# EAGLE design mainboard (EAGLE 9.6.1)
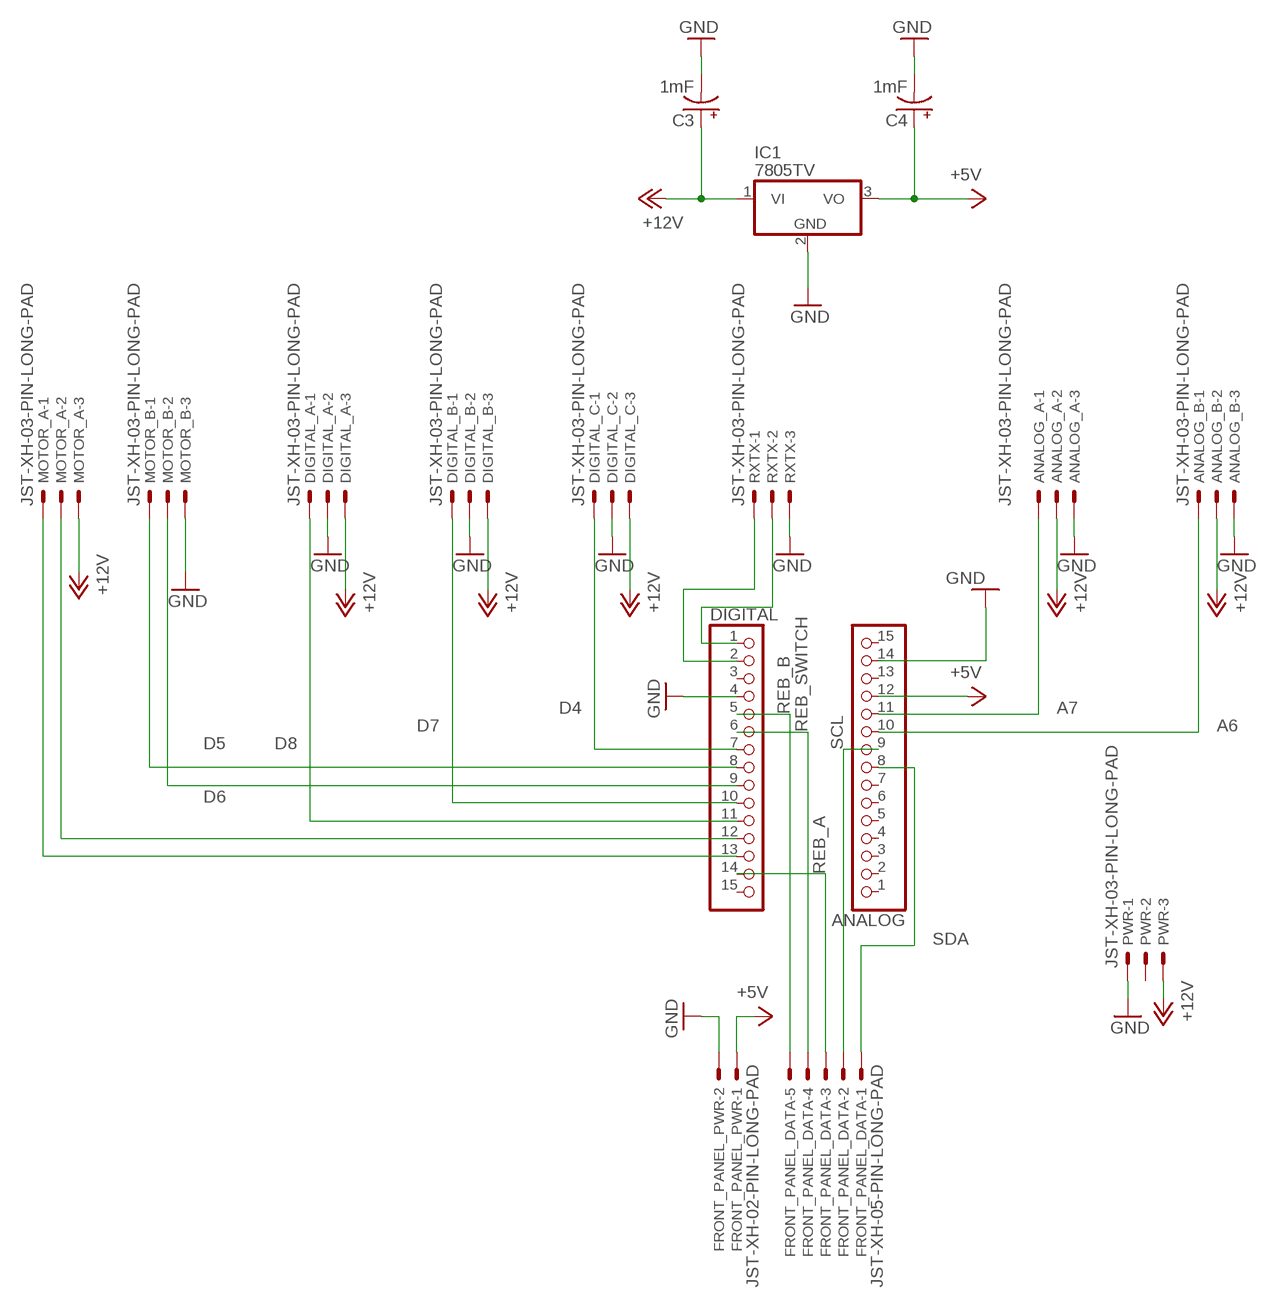
[diagram p0: schematic, sheet 1]

## Parts
ANALOG  PINHD-1X15  [1X15]
ANALOG_A  JST-XH-03-PIN-LONG-PAD  [JST-XH-03-PACKAGE-LONG-PAD]
ANALOG_B  JST-XH-03-PIN-LONG-PAD  [JST-XH-03-PACKAGE-LONG-PAD]
C3  1mF  1000UF-RADIAL-5MM-25V-20%  [CPOL-RADIAL-5MM-10MM]
C4  1mF  1000UF-RADIAL-5MM-25V-20%  [CPOL-RADIAL-5MM-10MM]
DIGITAL  PINHD-1X15  [1X15]
DIGITAL_A  JST-XH-03-PIN-LONG-PAD  [JST-XH-03-PACKAGE-LONG-PAD]
DIGITAL_B  JST-XH-03-PIN-LONG-PAD  [JST-XH-03-PACKAGE-LONG-PAD]
DIGITAL_C  JST-XH-03-PIN-LONG-PAD  [JST-XH-03-PACKAGE-LONG-PAD]
FRONT_PANEL_DATA  JST-XH-05-PIN-LONG-PAD  [JST-XH-05-PACKAGE-LONG-PAD]
FRONT_PANEL_PWR  JST-XH-02-PIN-LONG-PAD  [JST-XH-02-PACKAGE-LONG-PAD]
IC1  7805TV  [TO220V]
MOTOR_A  JST-XH-03-PIN-LONG-PAD  [JST-XH-03-PACKAGE-LONG-PAD]
MOTOR_B  JST-XH-03-PIN-LONG-PAD  [JST-XH-03-PACKAGE-LONG-PAD]
PWR  JST-XH-03-PIN-LONG-PAD  [JST-XH-03-PACKAGE-LONG-PAD]
RXTX  JST-XH-03-PIN-LONG-PAD  [JST-XH-03-PACKAGE-LONG-PAD]

## Nets
+5V: ANALOG.12 C4.+ FRONT_PANEL_PWR.1 IC1.3(VO)
+12V: ANALOG_A.2 ANALOG_B.2 C3.+ DIGITAL_A.3 DIGITAL_B.3 DIGITAL_C.3 IC1.1(VI) MOTOR_A.3 PWR.3
A6: ANALOG.10 ANALOG_B.1
A7: ANALOG.11 ANALOG_A.1
D4: DIGITAL.7 DIGITAL_C.1
D5: DIGITAL.8 MOTOR_B.1
D6: DIGITAL.9 MOTOR_B.2
D7: DIGITAL.10 DIGITAL_B.1
D8: DIGITAL.11 DIGITAL_A.1
D9: DIGITAL.12 MOTOR_A.2
D10: DIGITAL.13 MOTOR_A.1
GND: ANALOG.14 ANALOG_A.3 ANALOG_B.3 C3.- C4.- DIGITAL.4 DIGITAL_A.2 DIGITAL_B.2 DIGITAL_C.2 FRONT_PANEL_PWR.2 IC1.2(GND) MOTOR_B.3 PWR.1 RXTX.3
REB_A: DIGITAL.14 FRONT_PANEL_DATA.3
REB_B: DIGITAL.5 FRONT_PANEL_DATA.5
REB_SWITCH: DIGITAL.6 FRONT_PANEL_DATA.4
RXD: DIGITAL.2 RXTX.1
SCL: ANALOG.9 FRONT_PANEL_DATA.2
SDA: ANALOG.8 FRONT_PANEL_DATA.1
TXD: DIGITAL.1 RXTX.2
Unconnected: ANALOG.1 ANALOG.2 ANALOG.3 ANALOG.4 ANALOG.5 ANALOG.6 ANALOG.7 ANALOG.13 ANALOG.15 DIGITAL.3 DIGITAL.15 PWR.2

## Library data of the parts
ANALOG DIGITAL = pinhead:PINHD-1X15: PIN HEADER
ANALOG_A ANALOG_B DIGITAL_A DIGITAL_B DIGITAL_C MOTOR_A MOTOR_B PWR RXTX = Rembrandt Electronics - JST XH Connectors v1-0:JST-XH-03-PIN: JST XH Connector 2 Pin Wire to board connector. Pitch: 2,54 mm, (0.100") Number of pins: 3 Created by Rembrandt Electronics www.rembrandtelectronics.com
C3 C4 = SparkFun-Capacitors:1000UF: 1,000µF/1mF ceramic capacitors A capacitor is a passive two-terminal electrical component used to store electrical energy temporarily in an electric field. CAP-08070; PROD_ID: CAP-09538
FRONT_PANEL_DATA = Rembrandt Electronics - JST XH Connectors v1-0:JST-XH-05-PIN: JST XH Connector 2 Pin Wire to board connector. Pitch: 2,54 mm, (0.100") Number of pins: 5 Created by Rembrandt Electronics www.rembrandtelectronics.com
FRONT_PANEL_PWR = Rembrandt Electronics - JST XH Connectors v1-0:JST-XH-02-PIN: JST XH Connector 2 Pin Wire to board connector. Pitch: 2,54 mm, (0.100") Number of pins: 2 Created by Rembrandt Electronics www.rembrandtelectronics.com
IC1 = linear:78*: Positive VOLTAGE REGULATOR Source: http://cache.national.com/ds/LM/LM78L05.pdf http://www.fairchildsemi.com/ds/LM/LM7805.pdf

## Board
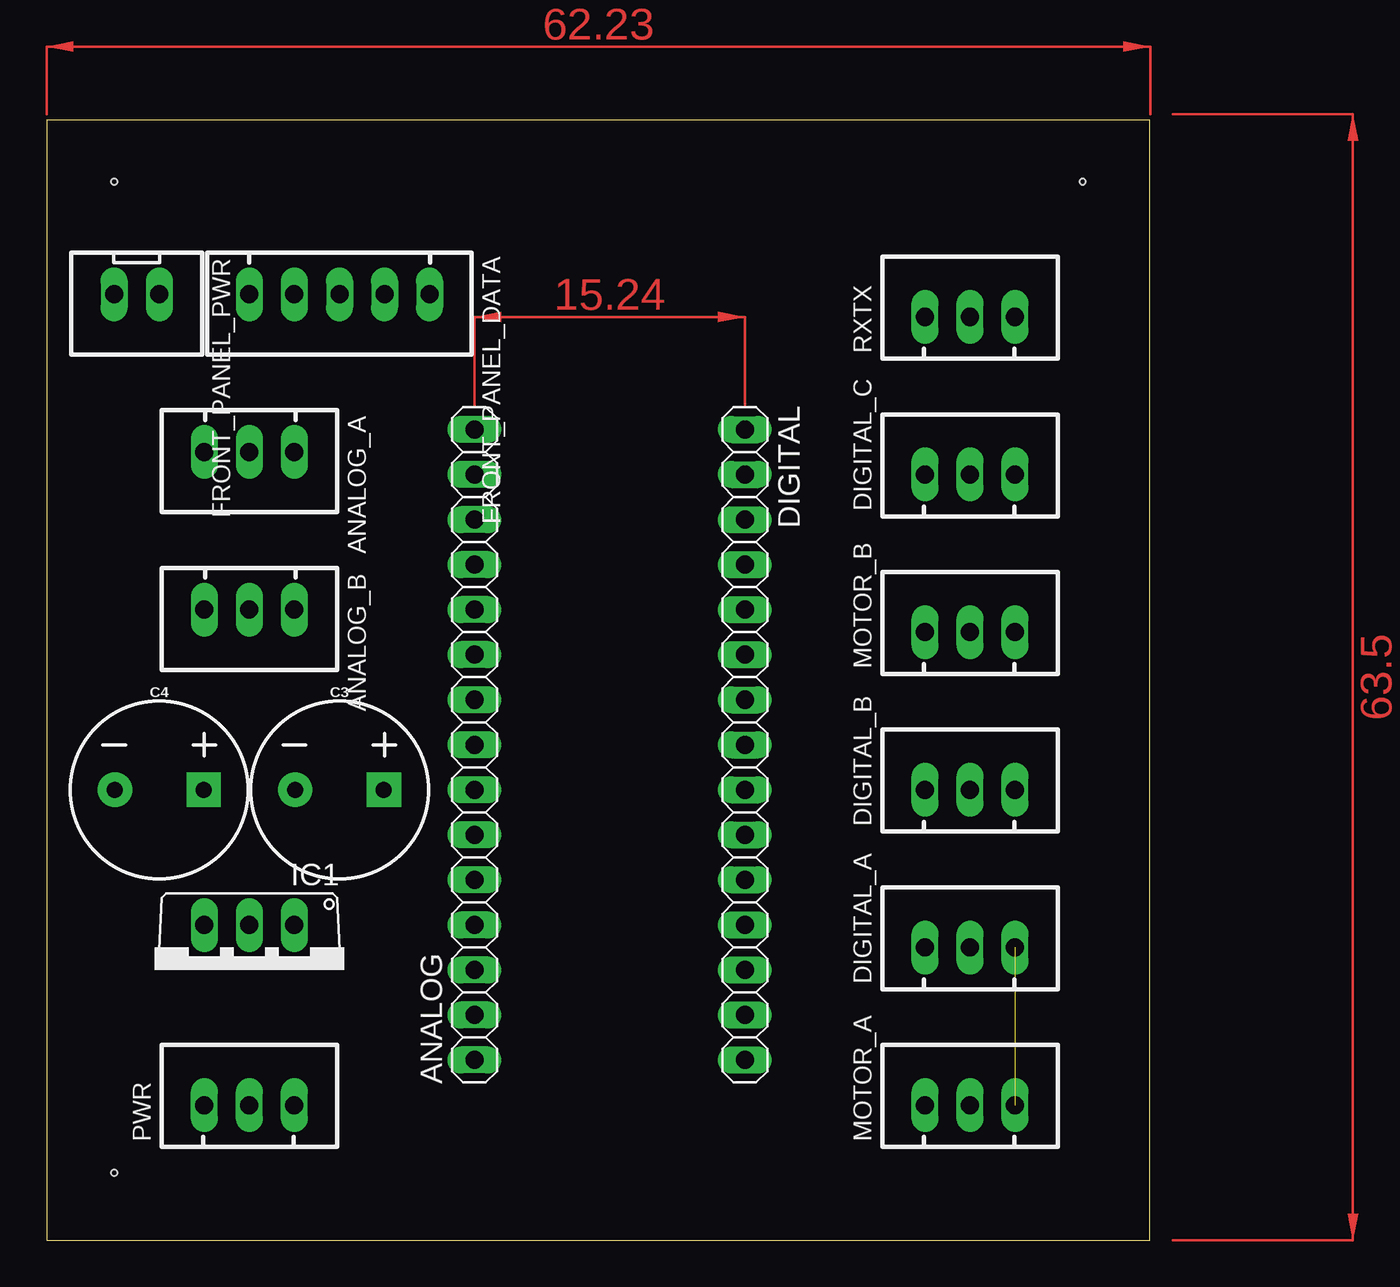
[diagram p1: board, top side]
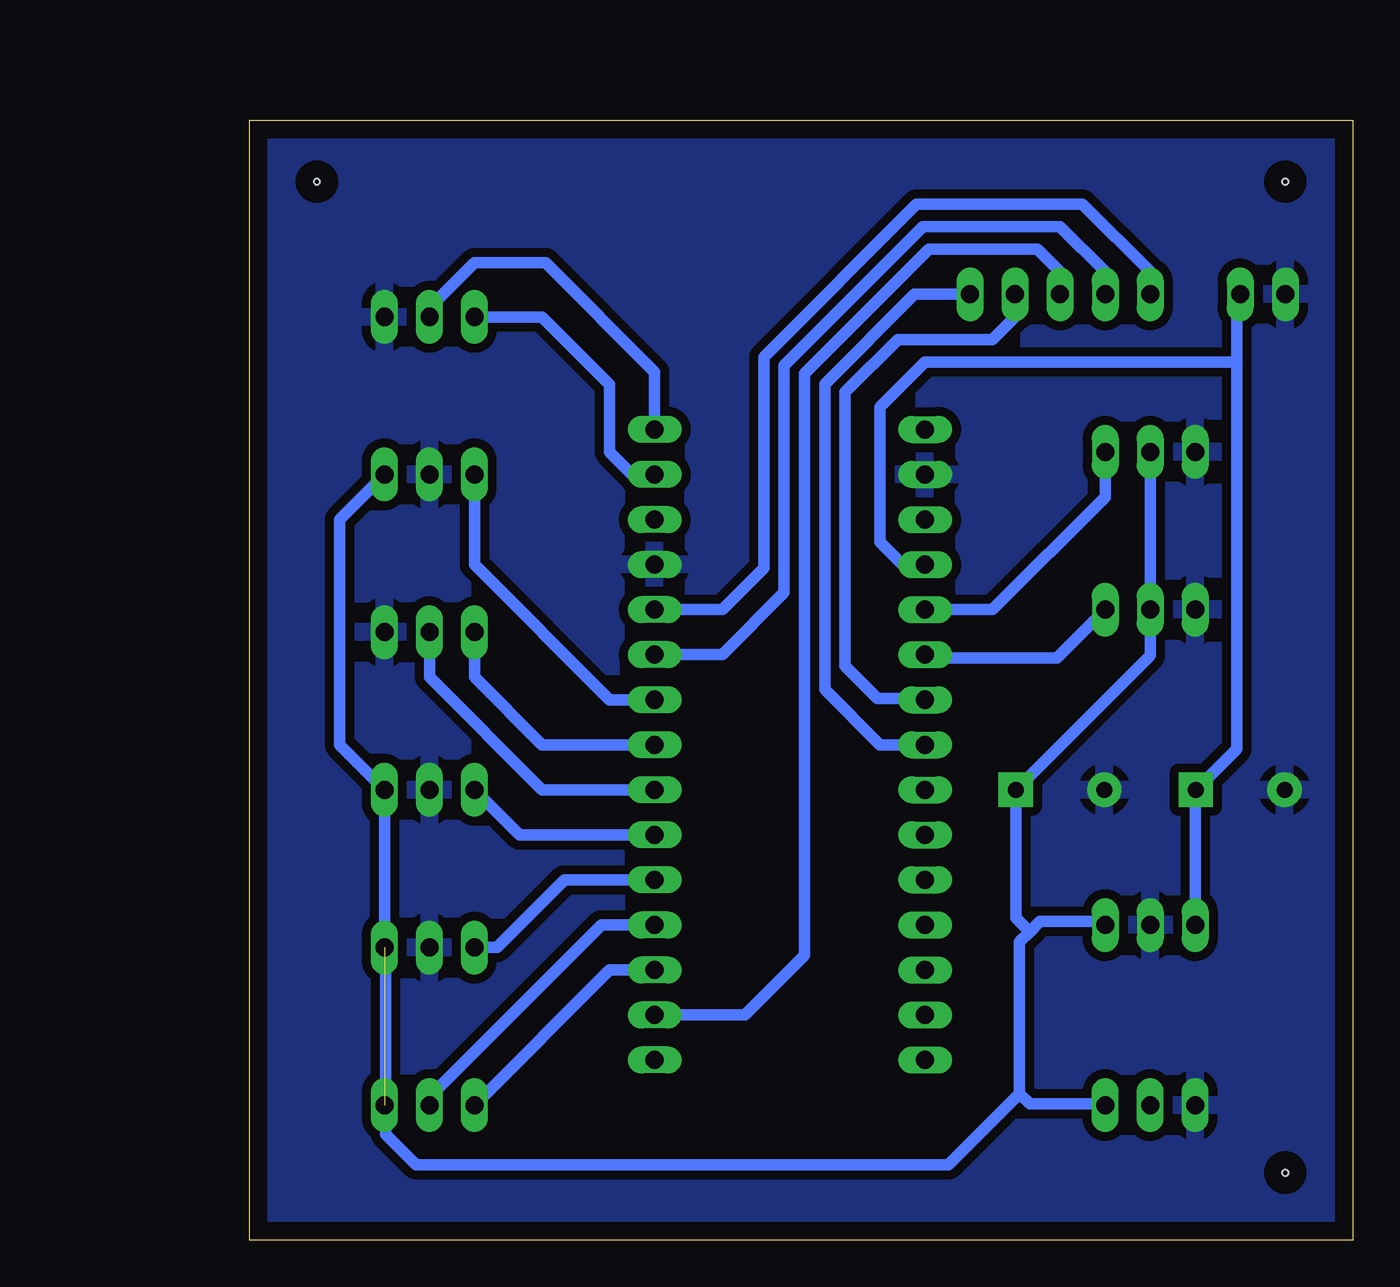
[diagram p2: board, bottom side, seen from below]

Size 62.21 x 63.17 mm. Coordinates in mm from the lower left corner, seen from the top.
Outline: 0,0 62.21,0 62.21,63.17 0,63.17 0,0
Copper layers (1*16): Top 0.035mm / dielectric 1.5mm / Bottom 0.035mm
Design rules "default2 *": minimum track width 25mil, minimum drill 0.35mm, track to track 20mil, track to pad 20mil, pad to pad 20mil, via to via 20mil, smd to smd 20mil, copper to edge 40mil, drill to drill 6mil, minimum pad ring 10mil, minimum via ring 8mil, stop-mask expansion 4mil, vias tented up to drill 0mil, thermal gap 20mil
Holes 0.35 mm at 3.81,3.81 58.42,59.69 3.81,59.69

### Footprints (pad centres in the part's own frame; a part is rotated, then mirrored left to right if it is on the bottom)
1X15 = drill 1.016 long: 1 -17.78,0; 2 -15.24,0; 3 -12.7,0; 4 -10.16,0; 5 -7.62,0; 6 -5.08,0; 7 -2.54,0; 8 0,0; 9 2.54,0; 10 5.08,0; 11 7.62,0; 12 10.16,0; 13 12.7,0; 14 15.24,0; 15 17.78,0
JST-XH-03-PACKAGE-LONG-PAD = drill 1.016 long: 1 -2.54,0; 2 0,0; 3 2.54,0
CPOL-RADIAL-5MM-10MM = drill 0.9 pad 1.93 square: + 2.5,0 | drill 0.9 pad 1.93: - -2.5,0
JST-XH-05-PACKAGE-LONG-PAD = drill 1.016 long: 1 -5.08,0; 2 -2.54,0; 3 0,0; 4 2.54,0; 5 5.08,0
JST-XH-02-PACKAGE-LONG-PAD = drill 1.016 long: 1 -1.27,0; 2 1.27,0
TO220V = drill 1.016 long: 1 -2.54,-2.54; 2 0,-2.54; 3 2.54,-2.54

### Placement (x,y rotation side)
ANALOG  24.13,27.94 90 top
ANALOG_A  11.43,44.45 180 top
ANALOG_B  11.43,35.56 180 top
C3  16.51,25.4 0 top
C4  6.35,25.4 0 top
DIGITAL  39.37,27.94 270 top
DIGITAL_A  52.07,16.51 0 top
DIGITAL_B  52.07,25.4 0 top
DIGITAL_C  52.07,43.18 0 top
FRONT_PANEL_DATA  16.51,53.34 180 top
FRONT_PANEL_PWR  5.08,53.34 180 top
IC1  11.43,15.24 180 top
MOTOR_A  52.07,7.62 0 top
MOTOR_B  52.07,34.29 0 top
PWR  11.43,7.62 0 top
RXTX  52.07,52.07 0 top

### Tracks (layer width: path | path; a pad name or v marks a point on that pad's centre or on a via)
+5V
  Bottom 0.635: 6.54,49.34 6.54,27.71 C4.+ | 6.54,49.34 6.6,49.34 6.79,49.53 24.13,49.53 26.67,46.99 26.67,39.37 25.4,38.1 ANALOG.12 | C4.+ 9.08,25.4 | 6.54,49.34 6.54,53.15 FRONT_PANEL_PWR.1 | C4.+ 8.89,25.36 IC1.3
+12V  (1 unrouted)
  Bottom 0.635: 18.8,8.26 18.22,7.68 13.97,7.68 PWR.3 | 18.8,8.26 18.8,16.83 18.22,17.4 | 18.22,17.4 17.65,17.97 13.97,17.97 IC1.1 | ANALOG_A.2 ANALOG_B.2 11.43,32.98 C3.+ 19.01,18.18 18.22,17.4 | 18.8,8.26 22.8,4.25 52.83,4.25 54.55,5.97 54.55,16.45 DIGITAL_A.3 DIGITAL_B.3 57.15,27.94 57.15,40.64 DIGITAL_C.3
A6
  Bottom 0.635: ANALOG_B.1 16.7,32.83 23.94,32.83 ANALOG.10
A7
  Bottom 0.635: ANALOG.11 20.32,35.56 13.97,41.91 ANALOG_A.1
D4
  Bottom 0.635: DIGITAL_C.1 49.53,38.1 41.91,30.48 DIGITAL.7
D5
  Bottom 0.635: MOTOR_B.1 49.53,31.75 45.72,27.94 DIGITAL.8
D6
  Bottom 0.635: MOTOR_B.2 52.07,31.75 45.72,25.4 DIGITAL.9
D7
  Bottom 0.635: DIGITAL_B.1 46.99,22.86 DIGITAL.10
D8
  Bottom 0.635: DIGITAL_A.1 48.26,16.51 44.45,20.32 DIGITAL.11
D9
  Bottom 0.635: MOTOR_A.2 52.07,8.09 42.38,17.78 DIGITAL.12
D10
  Bottom 0.635: DIGITAL.13 41.91,15.24 MOTOR_A.1
GND
  pour Bottom: 0,63.5 62.23,63.5 62.23,0 0,0
REB_A
  Bottom 0.635: DIGITAL.14 34.29,12.7 30.92,16.07 30.92,48.86 23.91,55.88 17.78,55.88 16.51,54.61 FRONT_PANEL_DATA.3
REB_B
  Bottom 0.635: DIGITAL.5 35.56,35.56 33.21,37.91 33.21,49.81 24.6,58.42 15.24,58.42 11.43,54.61 FRONT_PANEL_DATA.5
REB_SWITCH
  Bottom 0.635: DIGITAL.6 35.56,33.02 32.07,36.51 32.07,49.33 24.25,57.15 16.51,57.15 13.97,54.61 FRONT_PANEL_DATA.4
RXD
  Bottom 0.635: RXTX.1 45.72,52.07 41.91,48.26 41.91,44.45 40.64,43.18 DIGITAL.2
SCL
  Bottom 0.635: ANALOG.9 24.51,30.54 26.8,30.54 28.64,32.38 28.64,47.82 25.65,50.8 20.32,50.8 19.05,52.07 FRONT_PANEL_DATA.2
SDA
  Bottom 0.635: ANALOG.8 26.67,27.94 29.78,31.05 29.78,48.29 24.73,53.34 FRONT_PANEL_DATA.1
TXD
  Bottom 0.635: DIGITAL.1 39.37,48.96 45.53,55.12 49.53,55.12 51.94,52.7 51.94,52.26 RXTX.2
(copper drawn outside any net)
  shapes: Top area x3